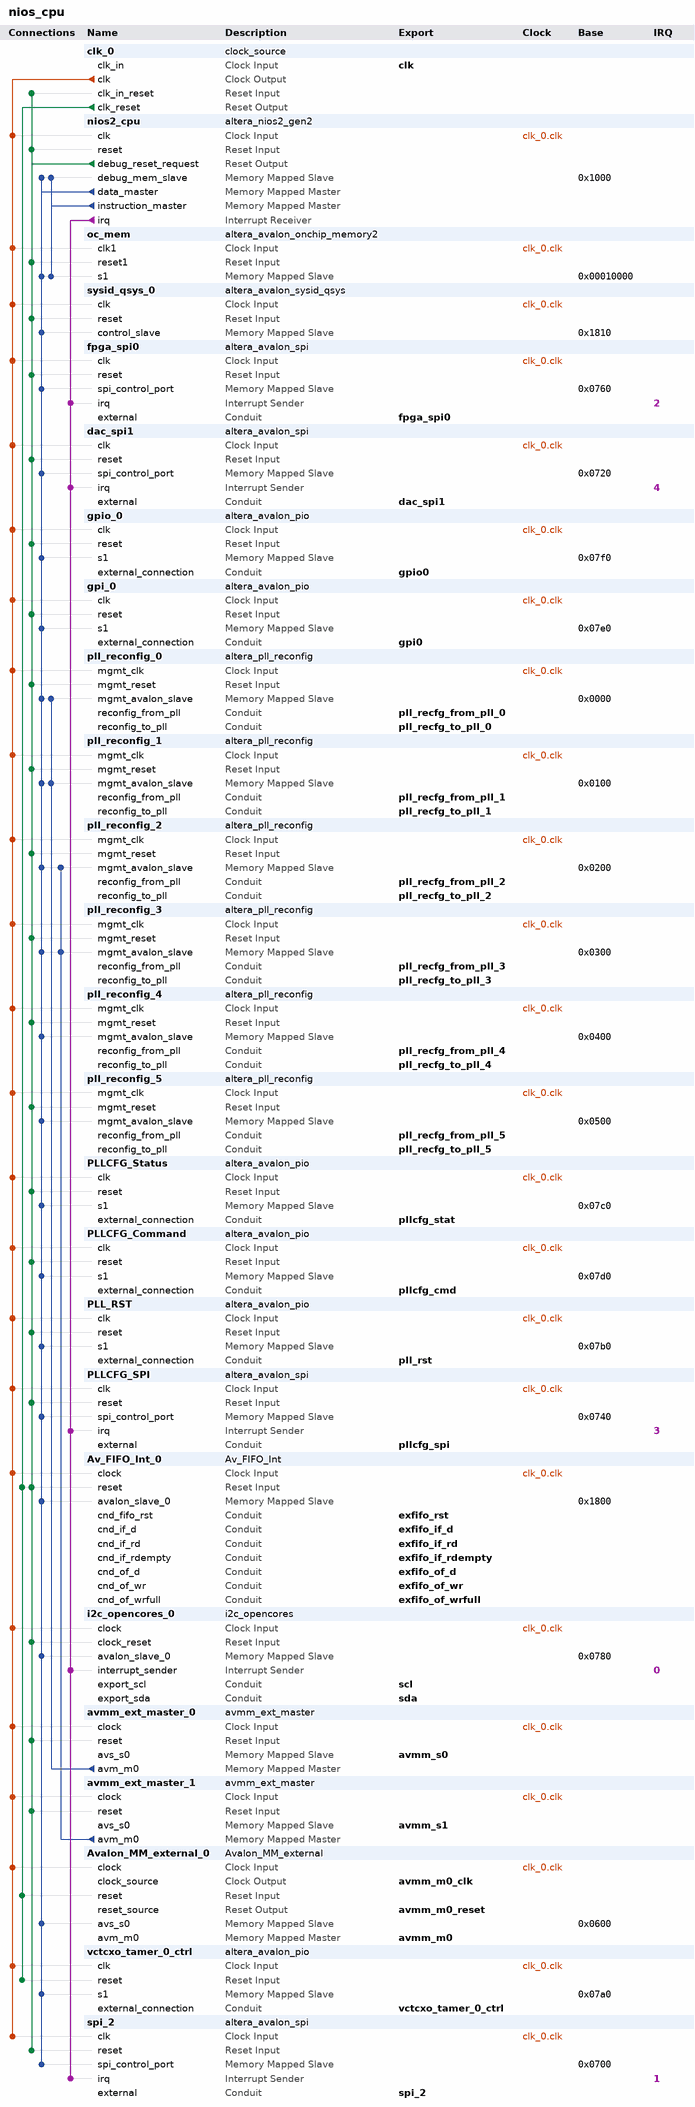
[diagram p0: system contents]
# Platform Designer (Qsys) system nios_cpu, Cyclone V 5CGXFC7D7F31C8
# Parameters at their usual value, and those the tool derives, are not listed.
package require -exact qsys 18.0
create_system nios_cpu
set_project_property DEVICE_FAMILY {Cyclone V}
set_project_property DEVICE 5CGXFC7D7F31C8

add_instance clk_0 clock_source 18.0
set_instance_parameter_value clk_0 clockFrequency 30720000

add_instance nios2_cpu altera_nios2_gen2 18.0
set_instance_parameter_value nios2_cpu dcache_size 2048
set_instance_parameter_value nios2_cpu exceptionSlave oc_mem.s1
set_instance_parameter_value nios2_cpu icache_size 4096
set_instance_parameter_value nios2_cpu impl Tiny
set_instance_parameter_value nios2_cpu resetSlave oc_mem.s1

add_instance oc_mem altera_avalon_onchip_memory2 18.0
set_instance_parameter_value oc_mem dataWidth 32
set_instance_parameter_value oc_mem dualPort false
set_instance_parameter_value oc_mem initMemContent true
set_instance_parameter_value oc_mem initializationFileName onchip_mem.hex
set_instance_parameter_value oc_mem memorySize 32768

add_instance sysid_qsys_0 altera_avalon_sysid_qsys 18.0
set_instance_parameter_value sysid_qsys_0 id 10

add_instance fpga_spi0 altera_avalon_spi 18.0
set_instance_parameter_value fpga_spi0 clockPolarity 0
set_instance_parameter_value fpga_spi0 dataWidth 8
set_instance_parameter_value fpga_spi0 masterSPI true
set_instance_parameter_value fpga_spi0 numberOfSlaves 8
set_instance_parameter_value fpga_spi0 targetClockRate 5000000

add_instance dac_spi1 altera_avalon_spi 18.0
set_instance_parameter_value dac_spi1 clockPhase 1
set_instance_parameter_value dac_spi1 clockPolarity 0
set_instance_parameter_value dac_spi1 dataWidth 8
set_instance_parameter_value dac_spi1 insertDelayBetweenSlaveSelectAndSClk true
set_instance_parameter_value dac_spi1 masterSPI true
set_instance_parameter_value dac_spi1 numberOfSlaves 1
set_instance_parameter_value dac_spi1 targetClockRate 5000000
set_instance_parameter_value dac_spi1 targetSlaveSelectToSClkDelay 500.0

add_instance gpio_0 altera_avalon_pio 18.0
set_instance_parameter_value gpio_0 direction Output
set_instance_parameter_value gpio_0 width 8

add_instance gpi_0 altera_avalon_pio 18.0
set_instance_parameter_value gpi_0 direction Input
set_instance_parameter_value gpi_0 width 8

add_instance pll_reconfig_0 altera_pll_reconfig 18.0

add_instance pll_reconfig_1 altera_pll_reconfig 18.0

add_instance pll_reconfig_2 altera_pll_reconfig 18.0

add_instance pll_reconfig_3 altera_pll_reconfig 18.0

add_instance pll_reconfig_4 altera_pll_reconfig 18.0

add_instance pll_reconfig_5 altera_pll_reconfig 18.0

add_instance PLLCFG_Status altera_avalon_pio 18.0
set_instance_parameter_value PLLCFG_Status direction Output
set_instance_parameter_value PLLCFG_Status resetValue 1
set_instance_parameter_value PLLCFG_Status width 10

add_instance PLLCFG_Command altera_avalon_pio 18.0
set_instance_parameter_value PLLCFG_Command direction Input
set_instance_parameter_value PLLCFG_Command width 4

add_instance PLL_RST altera_avalon_pio 18.0
set_instance_parameter_value PLL_RST direction Output
set_instance_parameter_value PLL_RST width 32

add_instance PLLCFG_SPI altera_avalon_spi 18.0
set_instance_parameter_value PLLCFG_SPI clockPolarity 0
set_instance_parameter_value PLLCFG_SPI dataWidth 8
set_instance_parameter_value PLLCFG_SPI masterSPI true
set_instance_parameter_value PLLCFG_SPI numberOfSlaves 1
set_instance_parameter_value PLLCFG_SPI targetClockRate 10000000

add_instance Av_FIFO_Int_0 Av_FIFO_Int 1.0
set_instance_parameter_value Av_FIFO_Int_0 width 32

add_instance i2c_opencores_0 i2c_opencores 13.0

add_instance avmm_ext_master_0 avmm_ext_master 1.0

add_instance avmm_ext_master_1 avmm_ext_master 1.0

add_instance Avalon_MM_external_0 Avalon_MM_external 1.0

add_instance vctcxo_tamer_0_ctrl altera_avalon_pio 18.0
set_instance_parameter_value vctcxo_tamer_0_ctrl direction Input
set_instance_parameter_value vctcxo_tamer_0_ctrl width 4

add_instance spi_2 altera_avalon_spi 18.0
set_instance_parameter_value spi_2 clockPolarity 1
set_instance_parameter_value spi_2 dataWidth 8
set_instance_parameter_value spi_2 masterSPI true
set_instance_parameter_value spi_2 numberOfSlaves 1
set_instance_parameter_value spi_2 targetClockRate 5000000

# connections
add_connection clk_0.clk Av_FIFO_Int_0.clock clock
add_connection clk_0.clk Avalon_MM_external_0.clock clock
add_connection clk_0.clk avmm_ext_master_0.clock clock
add_connection clk_0.clk avmm_ext_master_1.clock clock
add_connection clk_0.clk dac_spi1.clk clock
add_connection clk_0.clk fpga_spi0.clk clock
add_connection clk_0.clk gpi_0.clk clock
add_connection clk_0.clk gpio_0.clk clock
add_connection clk_0.clk i2c_opencores_0.clock clock
add_connection clk_0.clk nios2_cpu.clk clock
add_connection clk_0.clk oc_mem.clk1 clock
add_connection clk_0.clk pll_reconfig_0.mgmt_clk clock
add_connection clk_0.clk pll_reconfig_1.mgmt_clk clock
add_connection clk_0.clk pll_reconfig_2.mgmt_clk clock
add_connection clk_0.clk pll_reconfig_3.mgmt_clk clock
add_connection clk_0.clk pll_reconfig_4.mgmt_clk clock
add_connection clk_0.clk pll_reconfig_5.mgmt_clk clock
add_connection clk_0.clk PLL_RST.clk clock
add_connection clk_0.clk PLLCFG_Command.clk clock
add_connection clk_0.clk PLLCFG_SPI.clk clock
add_connection clk_0.clk PLLCFG_Status.clk clock
add_connection clk_0.clk spi_2.clk clock
add_connection clk_0.clk sysid_qsys_0.clk clock
add_connection clk_0.clk vctcxo_tamer_0_ctrl.clk clock
add_connection clk_0.clk_reset Av_FIFO_Int_0.reset reset
add_connection clk_0.clk_reset Avalon_MM_external_0.reset reset
add_connection clk_0.clk_reset vctcxo_tamer_0_ctrl.reset reset
add_connection nios2_cpu.debug_reset_request Av_FIFO_Int_0.reset reset
add_connection nios2_cpu.debug_reset_request avmm_ext_master_0.reset reset
add_connection nios2_cpu.debug_reset_request avmm_ext_master_1.reset reset
add_connection nios2_cpu.debug_reset_request clk_0.clk_in_reset reset
add_connection nios2_cpu.debug_reset_request dac_spi1.reset reset
add_connection nios2_cpu.debug_reset_request fpga_spi0.reset reset
add_connection nios2_cpu.debug_reset_request gpi_0.reset reset
add_connection nios2_cpu.debug_reset_request gpio_0.reset reset
add_connection nios2_cpu.debug_reset_request i2c_opencores_0.clock_reset reset
add_connection nios2_cpu.debug_reset_request nios2_cpu.reset reset
add_connection nios2_cpu.debug_reset_request oc_mem.reset1 reset
add_connection nios2_cpu.debug_reset_request pll_reconfig_0.mgmt_reset reset
add_connection nios2_cpu.debug_reset_request pll_reconfig_1.mgmt_reset reset
add_connection nios2_cpu.debug_reset_request pll_reconfig_2.mgmt_reset reset
add_connection nios2_cpu.debug_reset_request pll_reconfig_3.mgmt_reset reset
add_connection nios2_cpu.debug_reset_request pll_reconfig_4.mgmt_reset reset
add_connection nios2_cpu.debug_reset_request pll_reconfig_5.mgmt_reset reset
add_connection nios2_cpu.debug_reset_request PLL_RST.reset reset
add_connection nios2_cpu.debug_reset_request PLLCFG_Command.reset reset
add_connection nios2_cpu.debug_reset_request PLLCFG_SPI.reset reset
add_connection nios2_cpu.debug_reset_request PLLCFG_Status.reset reset
add_connection nios2_cpu.debug_reset_request spi_2.reset reset
add_connection nios2_cpu.debug_reset_request sysid_qsys_0.reset reset
add_connection avmm_ext_master_0.avm_m0 pll_reconfig_0.mgmt_avalon_slave avalon
set_connection_parameter_value avmm_ext_master_0.avm_m0/pll_reconfig_0.mgmt_avalon_slave baseAddress 0x0000
add_connection avmm_ext_master_0.avm_m0 pll_reconfig_1.mgmt_avalon_slave avalon
set_connection_parameter_value avmm_ext_master_0.avm_m0/pll_reconfig_1.mgmt_avalon_slave baseAddress 0x0100
add_connection avmm_ext_master_1.avm_m0 pll_reconfig_2.mgmt_avalon_slave avalon
set_connection_parameter_value avmm_ext_master_1.avm_m0/pll_reconfig_2.mgmt_avalon_slave baseAddress 0x0200
add_connection avmm_ext_master_1.avm_m0 pll_reconfig_3.mgmt_avalon_slave avalon
set_connection_parameter_value avmm_ext_master_1.avm_m0/pll_reconfig_3.mgmt_avalon_slave baseAddress 0x0300
add_connection nios2_cpu.data_master Av_FIFO_Int_0.avalon_slave_0 avalon
set_connection_parameter_value nios2_cpu.data_master/Av_FIFO_Int_0.avalon_slave_0 baseAddress 0x1800
add_connection nios2_cpu.data_master Avalon_MM_external_0.avs_s0 avalon
set_connection_parameter_value nios2_cpu.data_master/Avalon_MM_external_0.avs_s0 baseAddress 0x0600
add_connection nios2_cpu.data_master dac_spi1.spi_control_port avalon
set_connection_parameter_value nios2_cpu.data_master/dac_spi1.spi_control_port baseAddress 0x0720
add_connection nios2_cpu.data_master fpga_spi0.spi_control_port avalon
set_connection_parameter_value nios2_cpu.data_master/fpga_spi0.spi_control_port baseAddress 0x0760
add_connection nios2_cpu.data_master gpi_0.s1 avalon
set_connection_parameter_value nios2_cpu.data_master/gpi_0.s1 baseAddress 0x07e0
add_connection nios2_cpu.data_master gpio_0.s1 avalon
set_connection_parameter_value nios2_cpu.data_master/gpio_0.s1 baseAddress 0x07f0
add_connection nios2_cpu.data_master i2c_opencores_0.avalon_slave_0 avalon
set_connection_parameter_value nios2_cpu.data_master/i2c_opencores_0.avalon_slave_0 baseAddress 0x0780
add_connection nios2_cpu.data_master nios2_cpu.debug_mem_slave avalon
set_connection_parameter_value nios2_cpu.data_master/nios2_cpu.debug_mem_slave baseAddress 0x1000
add_connection nios2_cpu.data_master oc_mem.s1 avalon
set_connection_parameter_value nios2_cpu.data_master/oc_mem.s1 baseAddress 0x00010000
add_connection nios2_cpu.data_master pll_reconfig_0.mgmt_avalon_slave avalon
set_connection_parameter_value nios2_cpu.data_master/pll_reconfig_0.mgmt_avalon_slave baseAddress 0x0000
add_connection nios2_cpu.data_master pll_reconfig_1.mgmt_avalon_slave avalon
set_connection_parameter_value nios2_cpu.data_master/pll_reconfig_1.mgmt_avalon_slave baseAddress 0x0100
add_connection nios2_cpu.data_master pll_reconfig_2.mgmt_avalon_slave avalon
set_connection_parameter_value nios2_cpu.data_master/pll_reconfig_2.mgmt_avalon_slave baseAddress 0x0200
add_connection nios2_cpu.data_master pll_reconfig_3.mgmt_avalon_slave avalon
set_connection_parameter_value nios2_cpu.data_master/pll_reconfig_3.mgmt_avalon_slave baseAddress 0x0300
add_connection nios2_cpu.data_master pll_reconfig_4.mgmt_avalon_slave avalon
set_connection_parameter_value nios2_cpu.data_master/pll_reconfig_4.mgmt_avalon_slave baseAddress 0x0400
add_connection nios2_cpu.data_master pll_reconfig_5.mgmt_avalon_slave avalon
set_connection_parameter_value nios2_cpu.data_master/pll_reconfig_5.mgmt_avalon_slave baseAddress 0x0500
add_connection nios2_cpu.data_master PLL_RST.s1 avalon
set_connection_parameter_value nios2_cpu.data_master/PLL_RST.s1 baseAddress 0x07b0
add_connection nios2_cpu.data_master PLLCFG_Command.s1 avalon
set_connection_parameter_value nios2_cpu.data_master/PLLCFG_Command.s1 baseAddress 0x07d0
add_connection nios2_cpu.data_master PLLCFG_SPI.spi_control_port avalon
set_connection_parameter_value nios2_cpu.data_master/PLLCFG_SPI.spi_control_port baseAddress 0x0740
add_connection nios2_cpu.data_master PLLCFG_Status.s1 avalon
set_connection_parameter_value nios2_cpu.data_master/PLLCFG_Status.s1 baseAddress 0x07c0
add_connection nios2_cpu.data_master spi_2.spi_control_port avalon
set_connection_parameter_value nios2_cpu.data_master/spi_2.spi_control_port baseAddress 0x0700
add_connection nios2_cpu.data_master sysid_qsys_0.control_slave avalon
set_connection_parameter_value nios2_cpu.data_master/sysid_qsys_0.control_slave baseAddress 0x1810
add_connection nios2_cpu.data_master vctcxo_tamer_0_ctrl.s1 avalon
set_connection_parameter_value nios2_cpu.data_master/vctcxo_tamer_0_ctrl.s1 baseAddress 0x07a0
add_connection nios2_cpu.instruction_master nios2_cpu.debug_mem_slave avalon
set_connection_parameter_value nios2_cpu.instruction_master/nios2_cpu.debug_mem_slave baseAddress 0x1000
add_connection nios2_cpu.instruction_master oc_mem.s1 avalon
set_connection_parameter_value nios2_cpu.instruction_master/oc_mem.s1 baseAddress 0x00010000
add_connection nios2_cpu.irq dac_spi1.irq interrupt
set_connection_parameter_value nios2_cpu.irq/dac_spi1.irq irqNumber 4
add_connection nios2_cpu.irq fpga_spi0.irq interrupt
set_connection_parameter_value nios2_cpu.irq/fpga_spi0.irq irqNumber 2
add_connection nios2_cpu.irq i2c_opencores_0.interrupt_sender interrupt
set_connection_parameter_value nios2_cpu.irq/i2c_opencores_0.interrupt_sender irqNumber 0
add_connection nios2_cpu.irq PLLCFG_SPI.irq interrupt
set_connection_parameter_value nios2_cpu.irq/PLLCFG_SPI.irq irqNumber 3
add_connection nios2_cpu.irq spi_2.irq interrupt
set_connection_parameter_value nios2_cpu.irq/spi_2.irq irqNumber 1

# exported interfaces
add_interface avmm_m0 avalon master
set_interface_property avmm_m0 EXPORT_OF Avalon_MM_external_0.avm_m0
add_interface avmm_m0_clk clock source
set_interface_property avmm_m0_clk EXPORT_OF Avalon_MM_external_0.clock_source
add_interface avmm_m0_reset reset source
set_interface_property avmm_m0_reset EXPORT_OF Avalon_MM_external_0.reset_source
add_interface avmm_s0 avalon slave
set_interface_property avmm_s0 EXPORT_OF avmm_ext_master_0.avs_s0
add_interface avmm_s1 avalon slave
set_interface_property avmm_s1 EXPORT_OF avmm_ext_master_1.avs_s0
add_interface clk clock sink
set_interface_property clk EXPORT_OF clk_0.clk_in
add_interface dac_spi1 conduit end
set_interface_property dac_spi1 EXPORT_OF dac_spi1.external
add_interface exfifo_if_d conduit end
set_interface_property exfifo_if_d EXPORT_OF Av_FIFO_Int_0.cnd_if_d
add_interface exfifo_if_rd conduit end
set_interface_property exfifo_if_rd EXPORT_OF Av_FIFO_Int_0.cnd_if_rd
add_interface exfifo_if_rdempty conduit end
set_interface_property exfifo_if_rdempty EXPORT_OF Av_FIFO_Int_0.cnd_if_rdempty
add_interface exfifo_of_d conduit end
set_interface_property exfifo_of_d EXPORT_OF Av_FIFO_Int_0.cnd_of_d
add_interface exfifo_of_wr conduit end
set_interface_property exfifo_of_wr EXPORT_OF Av_FIFO_Int_0.cnd_of_wr
add_interface exfifo_of_wrfull conduit end
set_interface_property exfifo_of_wrfull EXPORT_OF Av_FIFO_Int_0.cnd_of_wrfull
add_interface exfifo_rst conduit end
set_interface_property exfifo_rst EXPORT_OF Av_FIFO_Int_0.cnd_fifo_rst
add_interface fpga_spi0 conduit end
set_interface_property fpga_spi0 EXPORT_OF fpga_spi0.external
add_interface gpi0 conduit end
set_interface_property gpi0 EXPORT_OF gpi_0.external_connection
add_interface gpio0 conduit end
set_interface_property gpio0 EXPORT_OF gpio_0.external_connection
add_interface pll_recfg_from_pll_0 conduit end
set_interface_property pll_recfg_from_pll_0 EXPORT_OF pll_reconfig_0.reconfig_from_pll
add_interface pll_recfg_from_pll_1 conduit end
set_interface_property pll_recfg_from_pll_1 EXPORT_OF pll_reconfig_1.reconfig_from_pll
add_interface pll_recfg_from_pll_2 conduit end
set_interface_property pll_recfg_from_pll_2 EXPORT_OF pll_reconfig_2.reconfig_from_pll
add_interface pll_recfg_from_pll_3 conduit end
set_interface_property pll_recfg_from_pll_3 EXPORT_OF pll_reconfig_3.reconfig_from_pll
add_interface pll_recfg_from_pll_4 conduit end
set_interface_property pll_recfg_from_pll_4 EXPORT_OF pll_reconfig_4.reconfig_from_pll
add_interface pll_recfg_from_pll_5 conduit end
set_interface_property pll_recfg_from_pll_5 EXPORT_OF pll_reconfig_5.reconfig_from_pll
add_interface pll_recfg_to_pll_0 conduit end
set_interface_property pll_recfg_to_pll_0 EXPORT_OF pll_reconfig_0.reconfig_to_pll
add_interface pll_recfg_to_pll_1 conduit end
set_interface_property pll_recfg_to_pll_1 EXPORT_OF pll_reconfig_1.reconfig_to_pll
add_interface pll_recfg_to_pll_2 conduit end
set_interface_property pll_recfg_to_pll_2 EXPORT_OF pll_reconfig_2.reconfig_to_pll
add_interface pll_recfg_to_pll_3 conduit end
set_interface_property pll_recfg_to_pll_3 EXPORT_OF pll_reconfig_3.reconfig_to_pll
add_interface pll_recfg_to_pll_4 conduit end
set_interface_property pll_recfg_to_pll_4 EXPORT_OF pll_reconfig_4.reconfig_to_pll
add_interface pll_recfg_to_pll_5 conduit end
set_interface_property pll_recfg_to_pll_5 EXPORT_OF pll_reconfig_5.reconfig_to_pll
add_interface pll_rst conduit end
set_interface_property pll_rst EXPORT_OF PLL_RST.external_connection
add_interface pllcfg_cmd conduit end
set_interface_property pllcfg_cmd EXPORT_OF PLLCFG_Command.external_connection
add_interface pllcfg_spi conduit end
set_interface_property pllcfg_spi EXPORT_OF PLLCFG_SPI.external
add_interface pllcfg_stat conduit end
set_interface_property pllcfg_stat EXPORT_OF PLLCFG_Status.external_connection
add_interface scl conduit end
set_interface_property scl EXPORT_OF i2c_opencores_0.export_scl
add_interface sda conduit end
set_interface_property sda EXPORT_OF i2c_opencores_0.export_sda
add_interface spi_2 conduit end
set_interface_property spi_2 EXPORT_OF spi_2.external
add_interface vctcxo_tamer_0_ctrl conduit end
set_interface_property vctcxo_tamer_0_ctrl EXPORT_OF vctcxo_tamer_0_ctrl.external_connection

set_interconnect_requirement {$system} qsys_mm.clockCrossingAdapter HANDSHAKE
set_interconnect_requirement {$system} qsys_mm.enableEccProtection FALSE
set_interconnect_requirement {$system} qsys_mm.insertDefaultSlave FALSE
set_interconnect_requirement {$system} qsys_mm.maxAdditionalLatency 1

save_system nios_cpu.qsys
